# EAGLE design POWERBOARD5V_ver2-redo (EAGLE 6.4)
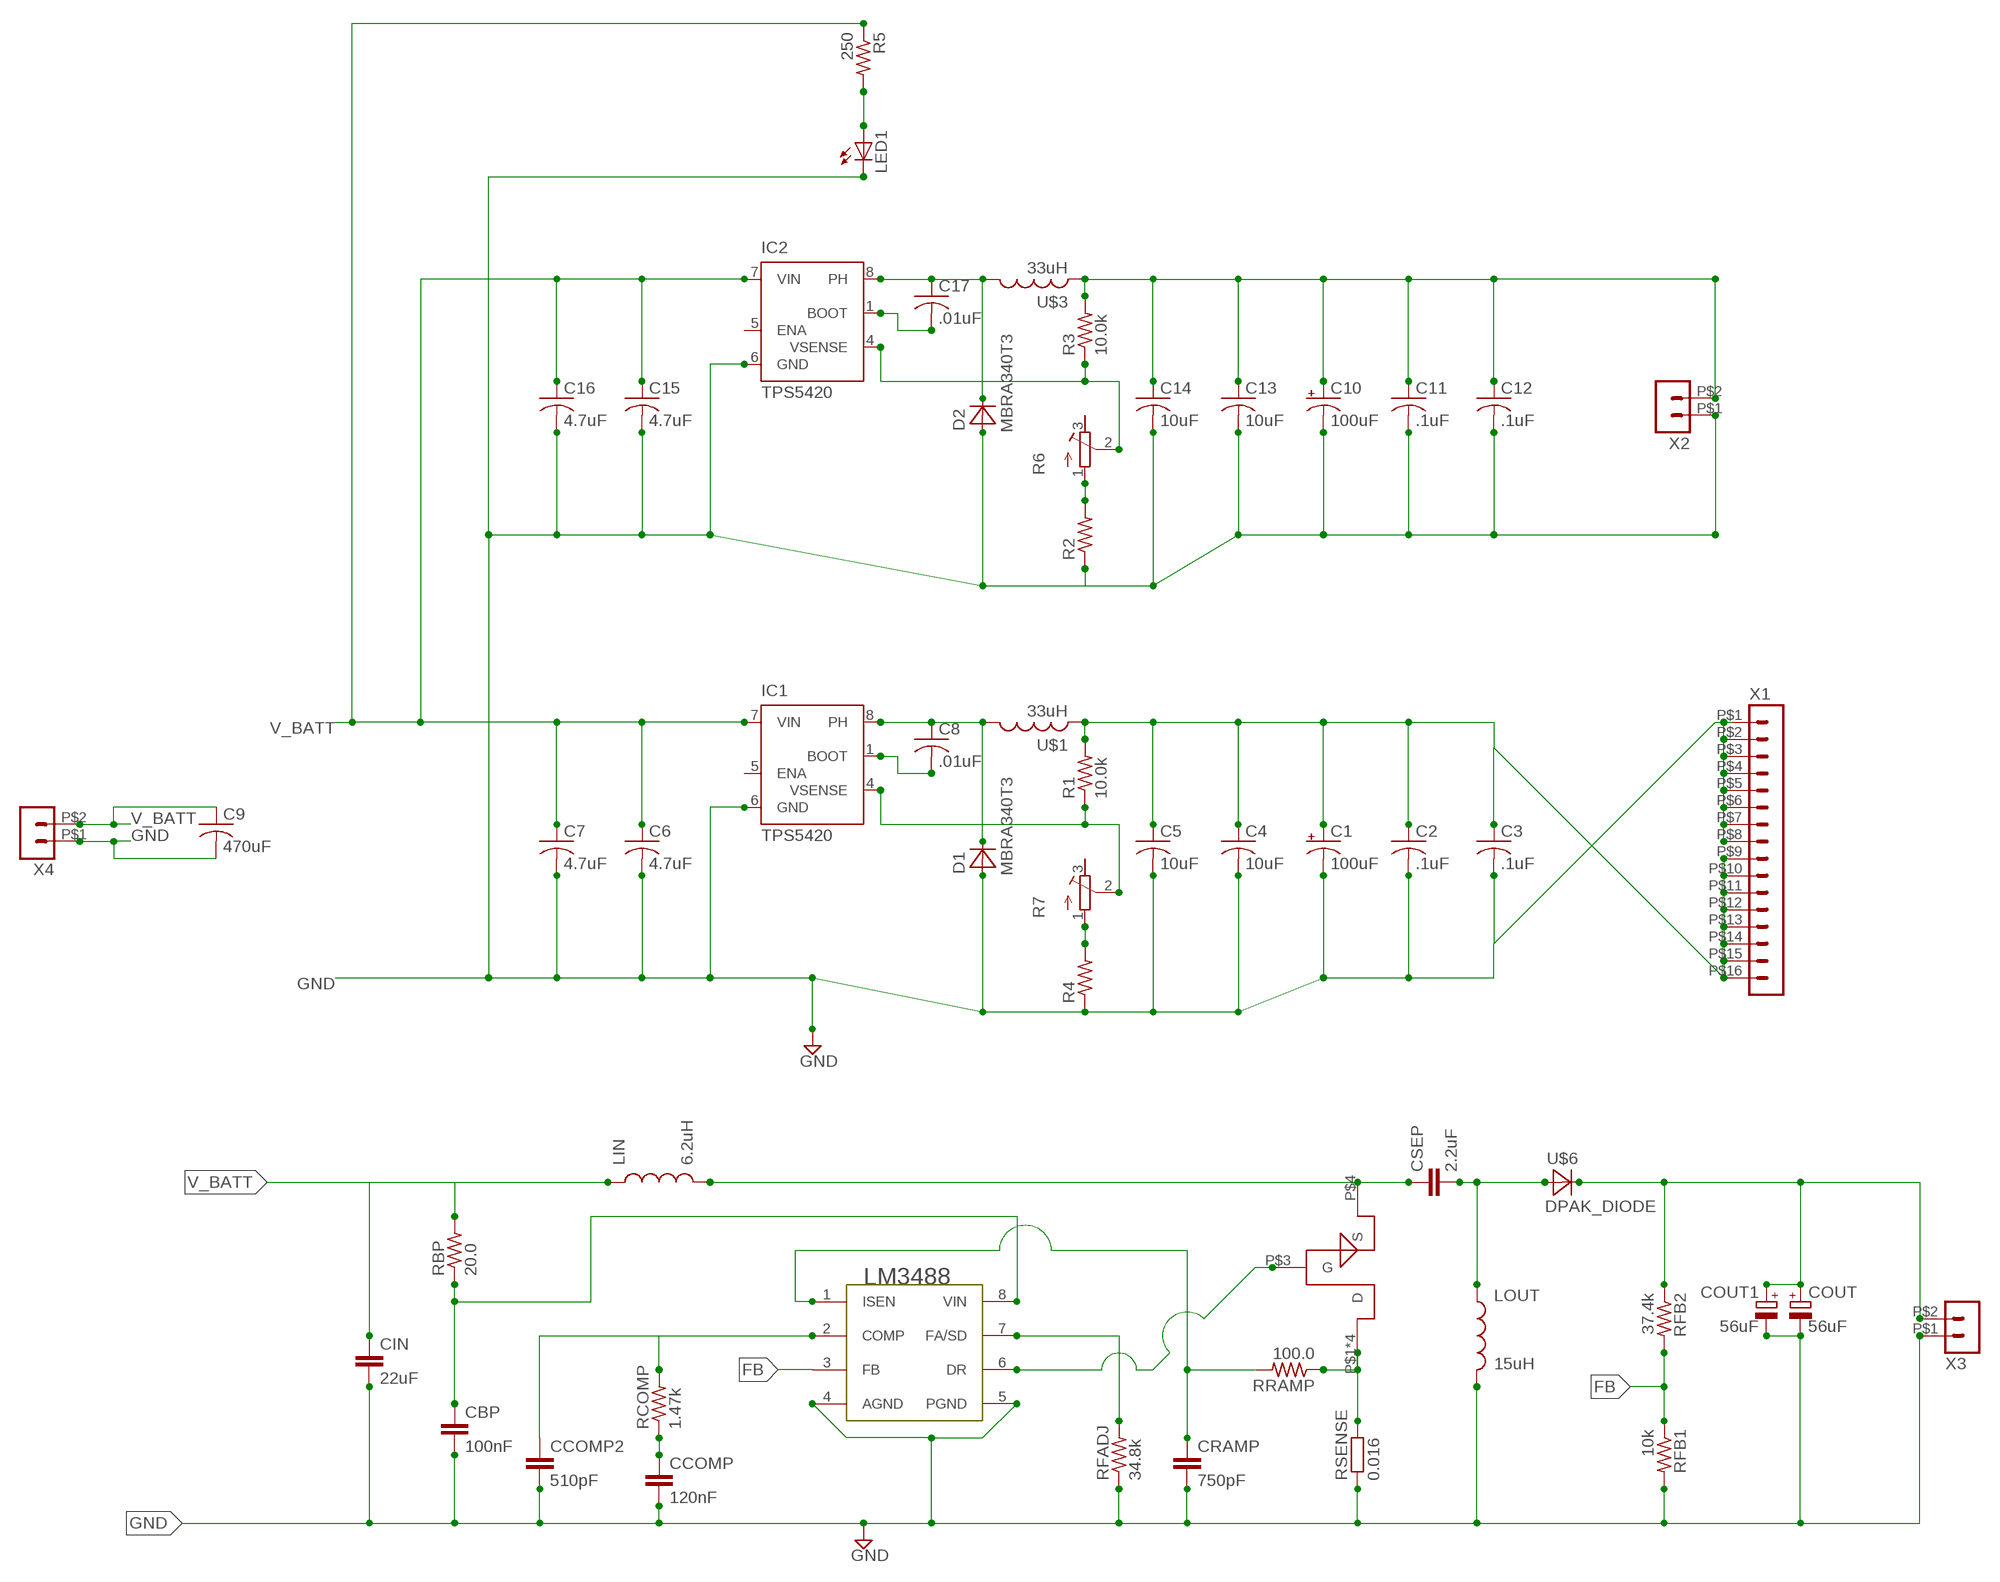
[diagram p0: schematic, sheet 1]

## Parts
C1  100uF  CPOL-USC/6032-28R  [C/6032-28R]
C2  .1uF  C-USC1206K  [C1206K]
C3  .1uF  C-USC1206K  [C1206K]
C4  10uF  C-USC1206K  [C1206K]
C5  10uF  C-USC1206K  [C1206K]
C6  4.7uF  C-USC1812K  [C1812K]
C7  4.7uF  C-USC1812K  [C1812K]
C8  .01uF  C-USC0805K  [C0805K]
C9  470uF  C-USC1812K  [C1812K]
C10  100uF  CPOL-USC/6032-28R  [C/6032-28R]
C11  .1uF  C-USC1206K  [C1206K]
C12  .1uF  C-USC1206K  [C1206K]
C13  10uF  C-USC1206K  [C1206K]
C14  10uF  C-USC1206K  [C1206K]
C15  4.7uF  C-USC1812K  [C1812K]
C16  4.7uF  C-USC1812K  [C1812K]
C17  .01uF  C-USC0805K  [C0805K]
CBP  100nF  C-EUC0805  [C0805]
CCOMP  120nF  C-EUC0805  [C0805]
CCOMP2  510pF  C-EUC0805  [C0805]
CIN  22uF  C-EUC0805  [C0805]
COUT  56uF  CPOL-EUSANYO_SMD_A5  [SANYO-OSCON_SMD_A5]
COUT1  56uF  CPOL-EUSANYO_SMD_A5  [SANYO-OSCON_SMD_A5]
CRAMP  750pF  C-EUC0805  [C0805]
CSEP  2.2uF  C-EUC0805  [C0805]
D1  MBRA340T3  [SMA]
D2  MBRA340T3  [SMA]
IC1  TPS5420  [D_R-PDSO-G08]
IC2  TPS5420  [D_R-PDSO-G08]
LED1  LEDSML1206  [SML1206]
LIN  6.2uH  INDUCTORSRU1038  [SRU1038]
LOUT  15uH  INDUCTORSRU1038  [SRU1038]
R1  10.0k  R-US_R3216  [R3216]
R2  R-US_R3216  [R3216]
R3  10.0k  R-US_R3216  [R3216]
R4  R-US_R3216  [R3216]
R5  250  R-US_R1206  [R1206]
R6  R-TRIMM3224W  [RTRIM3224W]
R7  R-TRIMM3224W  [RTRIM3224W]
RBP  20.0  R-US_R0805  [R0805]
RCOMP  1.47k  R-US_R0805  [R0805]
RFADJ  34.8k  R-US_R0805  [R0805]
RFB1  10k  R-US_R0805  [R0805]
RFB2  37.4k  R-US_R0805  [R0805]
RRAMP  100.0  R-US_R0805  [R0805]
RSENSE  0.016  R-EU_R2512  [R2512]
U$1  33uH  MSS1260  [MSS1260]
U$2  LM3488  [SO08]
U$3  33uH  MSS1260  [MSS1260]
U$5  P-CHANNEL20V(D-S)MOSFET  [TSOP-6]
U$6  DPAK_DIODE  [DPAK]
X1  HEADER_POS16_43045-1606  [43045-1606]
X2  HEADER_POS2_43045-0206  [43045-0206]
X3  HEADER_POS2_43045-0206  [43045-0206]
X4  HEADER_POS2_43045-0206  [43045-0206]

## Nets
3_3V [power]: C10.+ C11.1 C12.1 C13.1 C14.1 R3.2 U$3.P$2 U$3.P$4 X2.P$2
5V [power]: C1.+ C2.1 C3.1 C4.1 C5.1 R1.2 U$1.P$2 U$1.P$4 X1.P$9 X1.P$10 X1.P$11 X1.P$12 X1.P$13 X1.P$14 X1.P$15 X1.P$16
6V [power]: COUT1.+ COUT.+ RFB2.1 U$6.4(C) X3.P$2
FB: RFB1.1 RFB2.2 U$2.3(FB)
GND [power]: C1.- C2.2 C3.2 C4.2 C5.2 C6.2 C7.2 C9.2 C10.- C11.2 C12.2 C13.2 C14.2 C15.2 C16.2 CBP.2 CCOMP2.2 CCOMP.2 CIN.2 COUT1.- COUT.- CRAMP.2 D1.A D2.A IC1.6(GND) IC2.6(GND) LED1.C LOUT.2 R2.1 R4.1 RFADJ.1 RFB1.2 RSENSE.1 U$2.4(AGND) U$2.5(PGND) X1.P$1 X1.P$2 X1.P$3 X1.P$4 X1.P$5 X1.P$6 X1.P$7 X1.P$8 X2.P$1 X3.P$1 X4.P$1
LINSIG: CSEP.1 LIN.2 U$5.P$4(S)
LSIG: CSEP.2 LOUT.1 U$6.1(A) U$6.3(A)
N$1: CCOMP.1 RCOMP.1
N$2: C8.2 IC1.1(BOOT)
N$3: CCOMP2.1 RCOMP.2 U$2.2(COMP)
N$5: IC1.4(VSENSE) R1.1 R7.2(S)
N$6: C8.1 D1.C IC1.8(PH) U$1.P$1 U$1.P$3
N$9: CBP.1 RBP.1 U$2.8(VIN)
N$10: C17.2 IC2.1(BOOT)
N$12: IC2.4(VSENSE) R3.1 R6.2(S)
N$13: C17.1 D2.C IC2.8(PH) U$3.P$1 U$3.P$3
N$17: LED1.A R5.2
N$18: R2.2 R6.1(A)
N$19: R4.2 R7.1(A)
N$20: RFADJ.2 U$2.7(FA/SD)
N$21: CRAMP.1 RRAMP.2 U$2.1(ISEN)
N$23: U$2.6(DR) U$5.P$3(G)
SIG1: RRAMP.1 RSENSE.2 U$5.P$1(D) U$5.P$2(D) U$5.P$5(D) U$5.P$6(D)
V_BATT [power]: C6.1 C7.1 C9.1 C15.1 C16.1 CIN.1 IC1.7(VIN) IC2.7(VIN) LIN.1 R5.1 RBP.2 X4.P$2
Unconnected: IC1.5(ENA) IC2.5(ENA) R6.3(E) R7.3(E)

## Library data of the parts
C1 C10 = rcl:CPOL-US: POLARIZED CAPACITOR, American symbol
C2-C8 C11-C17 = rcl:C-US: CAPACITOR, American symbol
C9 = resistor:C-US: CAPACITOR, American symbol
CBP CCOMP CCOMP2 CIN CRAMP CSEP = rcl:C-EU: CAPACITOR, European symbol
COUT COUT1 = rcl:CPOL-EU: POLARIZED CAPACITOR, European symbol
D1 D2 = diode:MBRA340T3: Surface Mount Schottky Power Rectifier Source: http://www.onsemi.com/pub_link/Collateral/MBRA340T3-D.PDF
IC1 IC2 = daniel:TPS5420: 1-A, WIDE INPUT RANGE, STEP-DOWN SWIFT? CONVERTER Source: U7 Texas TPS5410 Step Down Converter.pdf; MPN: TPS5410DR; OC_FARNELL: 1329596; OC_NEWARK: 18M3223
LED1 = led:LED: LED OSRAM: - CHIPLED LG R971, LG N971, LY N971, LG Q971, LY Q971, LO R971, LY R971 LH N974, LH R974 LS Q976, LO Q976, LY Q976 LO Q996 - Hyper CHIPLED LW Q18S LB Q993, LB Q99A, LB R99A - SideLED LS A670, LO A670, LY A670, LG A670, LP A670 LB A673, LV A673, LT A673, LW A673 LH A674 LY A675 LS A676, LA A676, LO A676, LY A676, LW A676 LS A679, LY A679, LG A679 - Hyper Micro SIDELED® LS Y876, LA Y876, LO Y876, LY Y876 LT Y87S - SmartLED LW L88C, LW L88S LB L89C, LB L89S, LG L890 LS L89K, LO L89K, LY L89K LS L896, LA L896, LO L896, LY L896 - TOPLED LS T670, LO T670, LY T670, LG T670, LP T670 LSG T670, LSP T670, LSY T670, LOP T670, LYG T670 LG T671, LOG T671, LSG T671 LB T673, LV T673, LT T673, LW T673 LH T674 LS T676, LA T676, LO T676, LY T676, LB T676, LH T676, LSB T676, LW T676 LB T67C, LV T67C, LT T67C, LS T67K, LO T67K, LY T67K, LW E67C LS E67B, LA E67B, LO E67B, LY E67B, LB E67C, LV E67C, LT E67C LW T67C LS T679, LY T679, LG T679 LS T770, LO T770, LY T770, LG T770, LP T770 LB T773, LV T773, LT T773, LW T773 LH T774 LS E675, LA E675, LY E675, LS T675 LS T776, LA T776, LO T776, LY T776, LB T776 LHGB T686 LT T68C, LB T68C - Hyper Mini TOPLED® LB M676 - Mini TOPLED Santana® LG M470 LS M47K, LO M47K, LY M47K Source: http://www.osram.convergy.de LUXEON: - LUMILED® LXK2-PW12-R00, LXK2-PW12-S00, LXK2-PW14-U00, LXK2-PW14-V00 LXK2-PM12-R00, LXK2-PM12-S00, LXK2-PM14-U00 LXK2-PE12-Q00, LXK2-PE12-R00, LXK2-PE12-S00, LXK2-PE14-T00, LXK2-PE14-U00 LXK2-PB12-K00, LXK2-PB12-L00, LXK2-PB12-M00, LXK2-PB14-N00, LXK2-PB14-P00, LXK2-PB14-Q00 LXK2-PR12-L00, LXK2-PR12-M00, LXK2-PR14-Q00, LXK2-PR14-R00 LXK2-PD12-Q00, LXK2-PD12-R00, LXK2-PD12-S00 LXK2-PH12-R00, LXK2-PH12-S00 LXK2-PL12-P00, LXK2-PL12-Q00, LXK2-PL12-R00 Source: www.luxeon.com KINGBRIGHT: KA-3528ASYC Source: www.kingbright.com
LIN LOUT = SparkFun-Passives:INDUCTOR: Inductors Basic Inductor/Choke - 0603 and 1206. Footprints are not proven and vary greatly between part numbers.
R1-R5 RBP RCOMP RFADJ RFB1 RFB2 RRAMP = rcl:R-US_: RESISTOR, American symbol
R6 R7 = rcl:R-TRIMM: Trimm resistor
RSENSE = rcl:R-EU_: RESISTOR, European symbol
U$1 U$3 = inductor-coilcraft-3:MSS1260: SMT Power Inductor
U$2 = 40xx:LM3488
U$5 = ngohara_parts:P-CHANNEL20V(D-S)MOSFET: Vishay Siliconix Power MOSFET Uses the TSOP6 package design, Gate is pin 3, Source pin 4, and Drain pins 1,2,5,6. Datasheet: http://www.vishay.com/docs/74495/si3443cd.pdf
U$6 = ngohara_parts:DPAK_DIODE: 50WQ04FNPBF Vishay-Semiconductor DPACK shaped diode Datasheet http://www.vishay.com/docs/94233/50wq04fn.pdf
X1 = con-molex-micro-fit-3_0:HEADER_POS16_?: Molex - Micro-Fit 3.0 Series connector, 3.00mm (0.118") pitch header, 16 positions.
X2-X4 = con-molex-micro-fit-3_0:HEADER_POS2_?: Molex - Micro-Fit 3.0 Series connector, 3.00mm (0.118") pitch header, 2 positions.

## Net classes
0 default: width 0.305 mm, drill 0.508 mm, clearance 0.254 mm
1 power: width 0.508 mm, drill 0.508 mm, clearance 0.508 mm

## Board
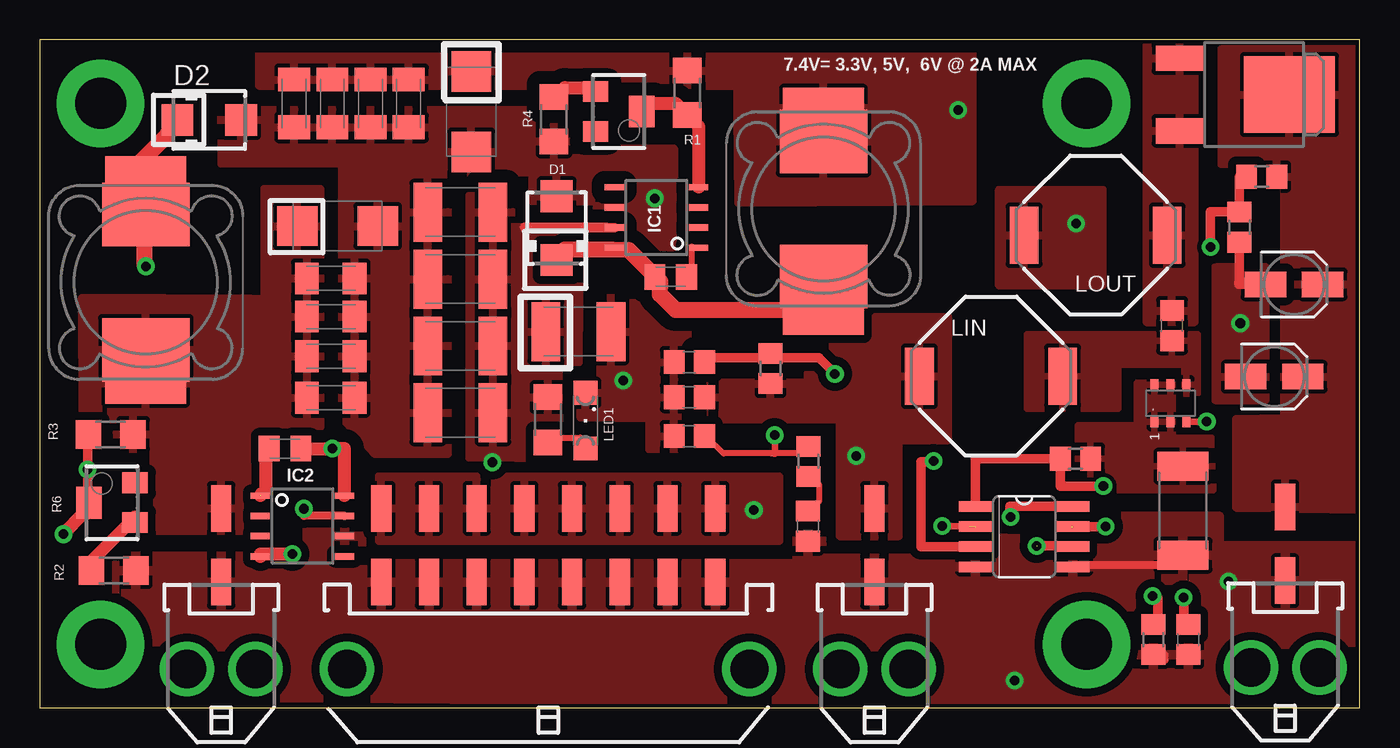
[diagram p1: board, top side]
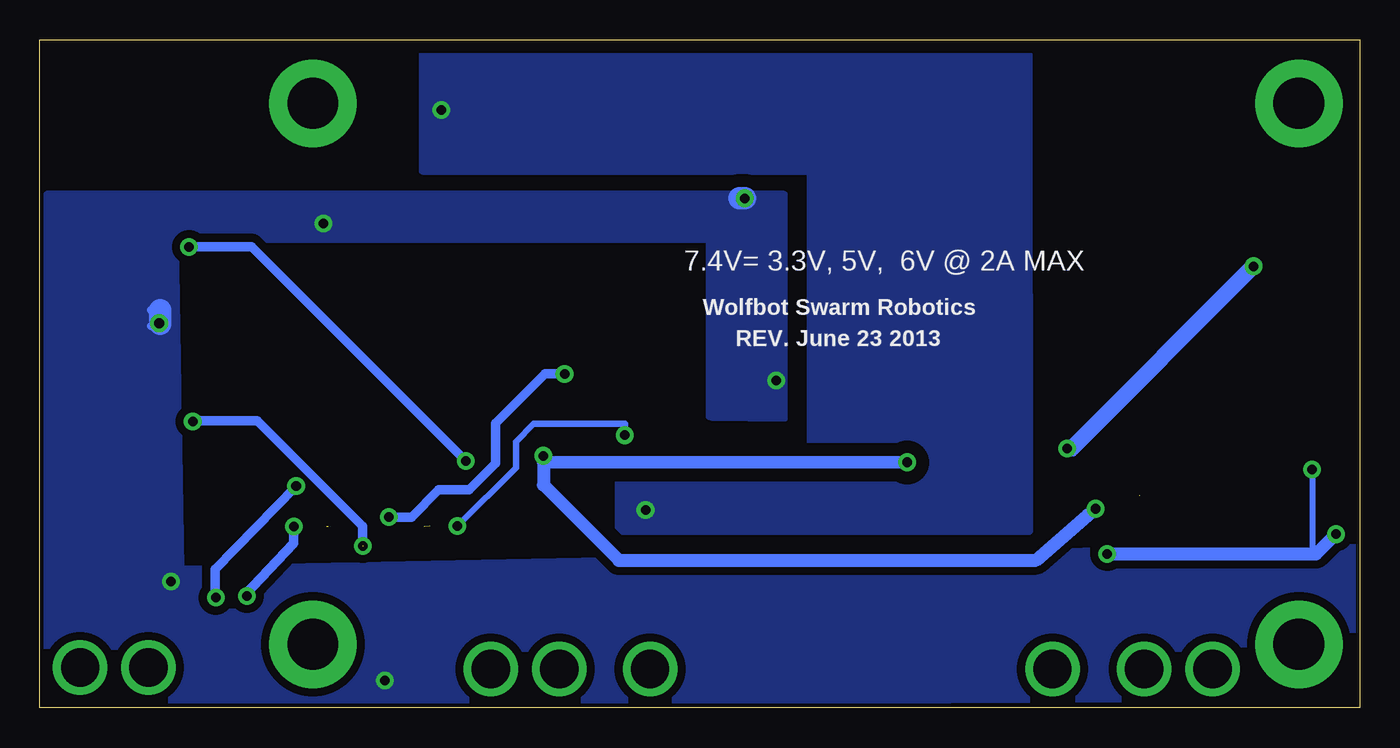
[diagram p2: board, bottom side, seen from below]

Size 83 x 42 mm. Coordinates in mm from the lower left corner, seen from the top.
Outline: 83,0 83,42 0,42 0,0 83,0
Copper layers (1*16): Top 0.035mm / dielectric 1.5mm / Bottom 0.035mm
Design rules "SparkFun": minimum track width 8mil, minimum drill 20mil, track to track 8mil, track to pad 8mil, pad to pad 8mil, via to via 8mil, smd to smd 8mil, copper to edge 10mil, drill to drill 8mil, minimum pad ring 12mil, minimum via ring 10mil, stop-mask expansion 4mil, vias tented up to drill 25mil, thermal gap 10mil

### Footprints (pad centres in the part's own frame; a part is rotated, then mirrored left to right if it is on the bottom)
C/6032-28R = smd 2.55 x 2.5: + 2.525,0; - -2.525,0
C1206K = smd 1.5 x 2: 1 -1.5,0; 2 1.5,0
C1812K = smd 1.8 x 3.7: 1 -2.05,0; 2 2.05,0
C0805K = smd 1.3 x 1.6: 1 -1,0; 2 1,0
C0805 = smd 1.3 x 1.5: 1 -0.95,0; 2 0.95,0
SANYO-OSCON_SMD_A5 = smd 2.6 x 1.6: + 1.8,0; - -1.8,0
SMA = smd 2 x 2: A 2,0; C -2,0
D_R-PDSO-G08 = smd 0.4 x 1.2: 1 0.555,-4.66; 2 1.825,-4.66; 3 3.095,-4.66; 4 4.365,-4.66; 5 4.365,0.64; 6 3.095,0.64; 7 1.825,0.64; 8 0.555,0.64
SML1206 = smd 1.5 x 1.5: A 1.75,0; C -1.75,0
SRU1038 = smd 1.8 x 3.6: 1 -4.5,0; 2 4.5,0
R3216 = smd 1.6 x 1.8: 1 -1.4,0; 2 1.4,0
R1206 = smd 1.6 x 1.803: 1 -1.422,0; 2 1.422,0
RTRIM3224W = smd 1.3 x 1.6: 1 -1.25,-1.45; 3 1.25,-1.45 | smd 2 x 1.6: 2 0,1.45
R0805 = smd 1.3 x 1.5: 1 -0.95,0; 2 0.95,0
R2512 = smd 1.8 x 3.2: 1 -2.8,0; 2 2.8,0
MSS1260 = smd 5.5 x 4: P$1 0,4.25; P$2 0,-4.25 | smd 5.08 x 2.54: P$3 0,6.64; P$4 0,-6.35
SO08 = smd 0.66 x 2.032: 1 -1.905,-3.073; 2 -0.635,-3.073; 3 0.635,-3.073; 4 1.905,-3.073; 5 1.905,3.073; 6 0.635,3.073; 7 -0.635,3.073; 8 -1.905,3.073
TSOP-6 = smd 0.508 x 0.699: P$1 0,-1.163; P$2 0,1.163; P$3 1.001,-1.163; P$4 1.001,1.163; P$5 -1.001,1.163; P$6 -1.001,-1.163
DPAK = smd 1.6 x 3: 1 -2.28,-5.31; 3 2.28,-5.31 | smd 4.826 x 5.715: 4 0,1.588
43045-1606 = smd 1.27 x 2.92: P$1 10.5,5.47; P$2 7.5,5.47; P$3 4.5,5.47; P$4 1.5,5.47; P$5 -1.5,5.47; P$6 -4.5,5.47; P$7 -7.5,5.47; P$8 -10.5,5.47; P$9 10.5,10.1; P$10 7.5,10.1; P$11 4.5,10.1; P$12 1.5,10.1; P$13 -1.5,10.1; P$14 -4.5,10.1; P$15 -7.5,10.1; P$16 -10.5,10.1 | drill 2.41: P$17 -12.65,0; P$18 12.65,0
43045-0206 = smd 1.27 x 2.92: P$1 0,5.47; P$2 0,10.1 | drill 2.41: P$3 -2.15,0; P$4 2.15,0

### Placement (x,y rotation side)
C1  27.13,37.48 90 top
C2  23.2,38 270 top
C3  20.8,38 270 top
C4  18.4,38 270 top
C5  16,38 270 top
C6  26.45,18.56 180 top
C7  26.45,22.76 180 top
C8  39.66,27.09 0 top
C9  33.87,23.66 0 top
C10  18.72,30.29 180 top
C11  18.3,27 0 top
C12  18.3,24.6 0 top
C13  18.3,22.1 0 top
C14  18.3,19.5 0 top
C15  26.45,31.16 180 top
C16  26.45,26.96 180 top
C17  15.42,16.31 180 top
CBP  40.84,21.74 180 top
CCOMP  48.31,11.43 270 top
CCOMP2  40.84,17.09 180 top
CIN  40.84,19.53 180 top
COUT  77.62,20.83 0 top
COUT1  78.87,26.62 0 top
CRAMP  72.22,4.3 270 top
CSEP  71.2,24.03 90 top
D1  32.5,30.16 90 top
D2  10.66,36.96 0 top
IC1  36.77,28.37 90 top
IC2  18.53,13.9 270 top
LED1  34.32,18.06 270 top
LIN  59.82,20.85 0 top
LOUT  66.4,29.72 180 top
R1  40.72,38.66 90 top
R2  4.65,8.64 180 top
R3  4.47,17.19 0 top
R4  32.33,37.01 90 top
R5  31.95,18.11 270 top
R6  4.55,12.9 90 top
R7  36.4,37.49 270 top
RBP  45.95,21.34 270 top
RCOMP  48.34,15.49 90 top
RFADJ  70.02,4.3 90 top
RFB1  75.44,30.23 270 top
RFB2  76.83,33.4 180 top
RRAMP  65.13,15.67 180 top
RSENSE  71.88,12.4 90 top
U$1  49.28,31.36 180 top
U$2  61.9,10.77 270 top
U$3  6.66,26.76 0 top
U$5  71.09,19.15 0 top
U$6  76.99,38.56 270 top
X1  31.97,2.44 0 top
X2  11.4,2.44 0 top
X3  78.31,2.54 0 top
X4  52.48,2.44 0 top

### Tracks (layer width: path | path; a pad name or v marks a point on that pad's centre or on a via)
3_3V
  pour Top: 2.69,18.14 4.8,18.14 4.83,16.28 7.15,16.28 7.17,11.12 14.45,11.12 14.35,17.7 17.65,17.65 17.65,32.61 14.1,32.61 14.1,25.7 13.23,25.73 2.64,25.77
5V  (via drill 0.6)
  other vias: 57.76,37.59 44.91,12.45
  pour Top (isolate 0.813): 47.12,41.53 13.77,41.45 13.77,39.12 43.84,39.12 43.84,37.41 43.92,31.75 58.67,31.85 58.67,41.63
  pour Bottom (isolate 0.813): 20.77,11.13 20.8,41 58.93,41.53 58.93,33.78 34.54,33.78 34.54,14.61 46.61,14.45 46.61,11.13
  pour Top: 46.48,14.55 46.48,10.49 21.34,10.49 21.34,14.58
6V
  pour Top: 83.06,12.47 83.06,41.4 74.3,41.4 74.3,34.19 78.23,34.24 78.23,18.21 75.21,18.16 75.21,12.6
FB  (via drill 0.6)
  Top 0.381: 58,10.13 U$2.3
  Top 0.61: 58,10.13 55.42,10.13 55.42,15.47 56.21,15.47 v56.21,15.52 | v73.61,28.98 73.61,31.18 RFB1.1 75.44,33.4 RFB2.2 75.82,33.4
  Bottom 0.61: v56.21,15.52 69.69,29 v73.61,28.98
GND  (via drill 0.6)
  Top 0.508: RSENSE.1 71,9 65,9 U$2.5 | CRAMP.2 71.72,3 71.72,3.37 | RFADJ.1 70.72,3 70.72,3.33
  Top 0.61: 75.82,26.75 75.39,26.75 75.39,26.62 COUT1.- 75.44,26.62 RFB1.2
  Bottom 0.508: 75.41,25 76,25 v75.49,24.18 76,24
  Bottom 0.61: 39,32 39,32.03
  Bottom 0.813: 38.68,32
  Bottom 1.422: 75.41,25 75.41,24.16 | 38.66,32.03 39,32.03
  other vias: 61.29,1.73 74.75,7.95 36.7,20.58 38.68,32.04 65.18,30.45
  pour Top (isolate 0.813): 19.02,34.21 11.43,34.19 11.4,37.59 33.11,37.59 33.19,35.2 39.88,35.18 39.83,24.18 40.77,24.16 40.77,16.26 38.33,16.26 38.35,18.19 34.01,18.24 34.01,20.24 35.26,20.24 35.26,25.81 37.54,25.78 37.47,31.29 35.03,31.29 35.03,31.83 30.99,31.8 30.99,33.63 25.65,33.63 25.65,15.95 21.08,15.95 19.02,18.23
  pour Top: 82.81,10.2 82.81,0.06 4.43,0.75 4.5,9.56 16.75,9.54 16.81,11.35 20.24,11.35 20.24,9.98 20.12,9.09 47.62,9.07 47.61,11.4 49.15,11.4 49.2,9.4 55.12,9.4 55.12,12.06 74.17,12.06 74.17,10.2
  pour Bottom: 82.55,32.26 82.6,0.28 0.43,0.66 0.1,10.16 74.14,8.69 74.47,29.49 40.89,29.46 40.89,18.36 40.77,18.31 36.2,18.24 36.2,32.26
  pour Top: 66.83,32.59 66.83,26.54 60.33,26.54 60.33,32.59
  pour Top: 73.91,19.35 77.09,19.35 77.09,27.71 73.91,27.71
LINSIG
  pour Top: 62.08,18.8 67.82,18.8 67.82,21.56 71.98,21.56 71.98,19.76 72.82,19.76 72.82,23.5 62.08,23.5
LSIG
  pour Top: 69.6,24.26 72.62,24.26 72.62,41.63 69.6,41.63
N$1
  Top 0.381: CCOMP.1 49,13 49,14 RCOMP.1
N$2
  Top 0.381: IC1.1 41,29 41,27 C8.2
N$3  (via drill 0.6)  (1 unrouted)
  Top 0.381: 46,16 48,16 RCOMP.2 | 46,16 43,16 42,17 CCOMP2.1 | 46,16 46.2,15.98
  Top 0.406: 46.2,15.98 46.23,15.98 46.23,16.87 46.2,16.87 v46.2,17.14 | v56.74,11.43 58.45,11.43 58.47,11.46
  Bottom 0.406: v56.74,11.43 53.06,15.11 53.06,16.74 51.94,17.86 46.2,17.86 v46.2,17.14
N$5
  Top 0.381: 38,38 R7.2
  Top 0.813: 38,38 40,38 R1.1 41.43,36.55 IC1.4
N$6
  Top 0.381: 36,28.82 IC1.8 | 48,26 47,25 | 39.02,26.8 C8.1 | 48,26 49,25 U$1.P$3 | 48,26 U$1.P$1
  Top 1.016: D1.C 33,28.82 36,28.82 37.02,28.8 39.02,26.8 39,26 40,25 47,25
N$9  (via drill 0.6)
  Top 0.381: 42,22 CBP.1 | 46,22 RBP.1 | 49,22 48.98,22 | 61,12 v61.05,12.01
  Top 0.61: 42,22 46,22 48.98,22 | 49,22 v50,21 | 61,12 61,12.68 U$2.8
  Bottom 0.381: 61,12 v61.05,12.01
  Bottom 0.61: v50,21 51.21,21 54.33,17.88 54.33,15.39 56.01,13.72 57.91,13.72 59.63,12 61,12
N$10  (1 unrouted)
  Top 0.381: C17.2 14,16 14.2,16
  Top 0.813: 14.2,16.2 14.2,16 14.2,13.69 13.87,13.36
N$11  (via drill 3.2 pad 5.5)
  other vias: 65.82,38
N$12  (via drill 0.6)
  Top 0.381: 3,17 R3.1 | 3,13 R6.2 3,12 2.78,12.22
  Top 0.61: 3,13 v3,15 3,17
  Top 0.813: 3.1,12.85 3.1,12.55 2.78,12.22 1.47,10.92 | IC2.4 13.87,9.68 v15.88,9.68
  Bottom 0.381: v3,15 3,9.68
  Bottom 0.813: v15.88,9.68 3,9.68 2.74,9.68 v1.5,10.92
N$13  (via drill 0.6)
  Top 0.381: 8,36 D2.C | 6,34 U$3.P$3 7,33 7,32 U$3.P$1 7,31 6.6,30.79 | v6.68,27.76 7,28 6.6,28
  Top 0.813: 6.6,30.79 6.63,30.81 | C17.1 v18.39,16.31 19.17,16.31 IC2.8
  Top 1.016: 6,34 8,36 | 6.6,27.76 6.6,28 6.6,30.79
  Bottom 0.381: v6.68,27.76 7,28 6.72,27.72 | 18,16 18.14,16.31
  Bottom 1.016: 6.63,27.81 v6.68,27.76 6.72,27.72 18.14,16.31 v18.39,16.31
N$14  (via drill 3.2 pad 5.5)
  other vias: 65.82,4
N$15  (via drill 3.2 pad 5.5)
  other vias: 3.82,4
N$16  (via drill 3.2 pad 5.5)
  other vias: 3.82,38
N$17
  Top 0.381: LED1.A 34,17 32,17 R5.2
N$18
  Top 0.381: 6,12 R6.1 | 3,9 R2.2
  Top 0.813: 3,9 6,12
N$19
  Top 0.381: 35,39 R7.1 | 33,39 R4.2
  Top 0.813: 33,39 35,39
N$20  (via drill 0.6)  (1 unrouted)
  Top 0.381: 69.72,5 RFADJ.2
  Top 0.61: 64.87,11.4 v67.03,11.4 | RFADJ.2 70.3,5.53 70.3,6.93 70.2,7.04 v69.98,7.04
  Bottom 0.381: v69.98,7.04 70,7 70.1,7.1
  Bottom 0.61: v67.03,11.4 67.03,10.34 70.1,7.1
N$21  (via drill 0.6)
  Top 0.381: 67,14 v66.88,13.95
  Top 0.61: CRAMP.1 71.93,5.25 v71.93,6.93 | U$2.1 58.83,15.67 RRAMP.2 64.18,13.95 v66.88,13.95
  Bottom 0.381: 72,7 71.98,6.96 | 72,7 v71.93,6.93 | 72,7 71.96,7
  Bottom 0.406: 71.96,6.96 71.96,7
  Bottom 0.61: 71.96,7 71.96,8.71 v66.88,13.95
N$23  (via drill 0.6)  (1 unrouted)
  Top 0.305: U$5.P$3 72,18 72.11,17.98
  Top 0.406: 72.11,17.98 73.38,17.98 v73.38,18.01
  Top 0.61: U$2.6 64.92,10.19 v62.69,10.19
  Bottom 0.381: v73.38,18.01 73,18 73,18.06 | 63,10 v62.69,10.19
  Bottom 0.406: 73,18.06 73.33,18.06 v73.38,18.01 73.41,17.98
  Bottom 0.61: 62.71,10.16 62.71,11.43 69.34,18.06 73,18.06
SIG1
  pour Top: 65.28,17.78 68.99,17.78 68.99,20.45 71.25,20.45 71.25,16.99 73.66,17.02 73.79,13.69 65.28,13.69
V_BATT  (via drill 0.6)
  Top 0.508: IC2.7 16.61,12.07 v16.61,12.52
  Top 0.61: 35.64,30.23 34.04,30.23 | 34.04,30.23 30.48,30.23 | IC1.7 34.04,30.19 34.04,30.23
  Bottom 0.508: v16.61,12.52 17,12 17.1,12.12
  Bottom 0.813: v28.45,15.44 51.33,15.42 | 51.33,15.42 v51.33,15.85 | 51.33,15.42 51.33,14.02 46.58,9.27 20.34,9.3 17.1,12.12 | 17.1,12.12 | 17.1,12.12 16.66,12.5
  pour Top: 50.29,18.16 50.29,10.79 54.03,10.79 54.03,16.84 57.15,16.84 57.15,24.57 48.36,24.55 48.26,20.45 42.16,20.45 42.16,18.16
  pour Top: 27.03,32.21 29.64,32.18 29.64,30.25 33.88,30.25 33.88,29.77 33.93,29.41 33.88,21.72 32.61,21.72 32.66,15.67 27.03,15.72

### Text on the board
tNames: 7.4V= 3.3V, 5V, 6V @ 2A MAX | . | 1
bNames: 7.4V= 3.3V, 5V, 6V @ 2A MAX | Wolfbot Swarm Robotics | REV. June 23 2013